# Altium schematic sheet TouchORkey.SchDoc
size A2
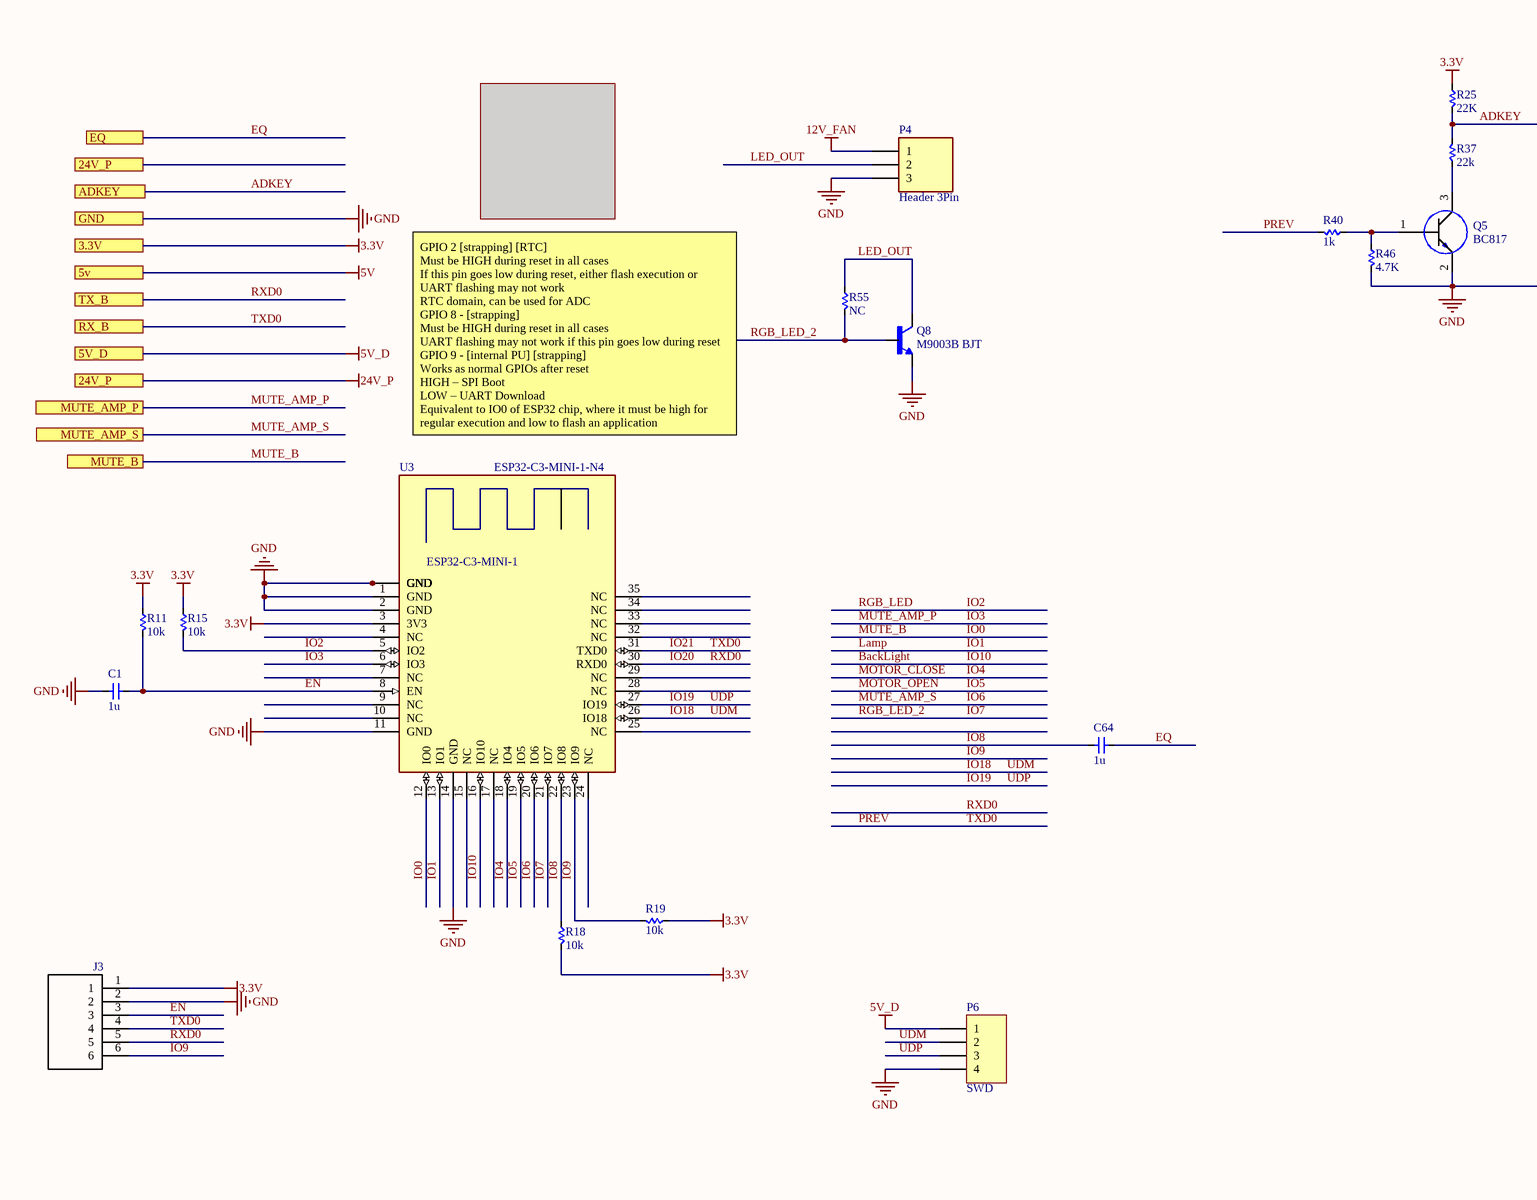
[diagram p0: TouchORkey.SchDoc, left]
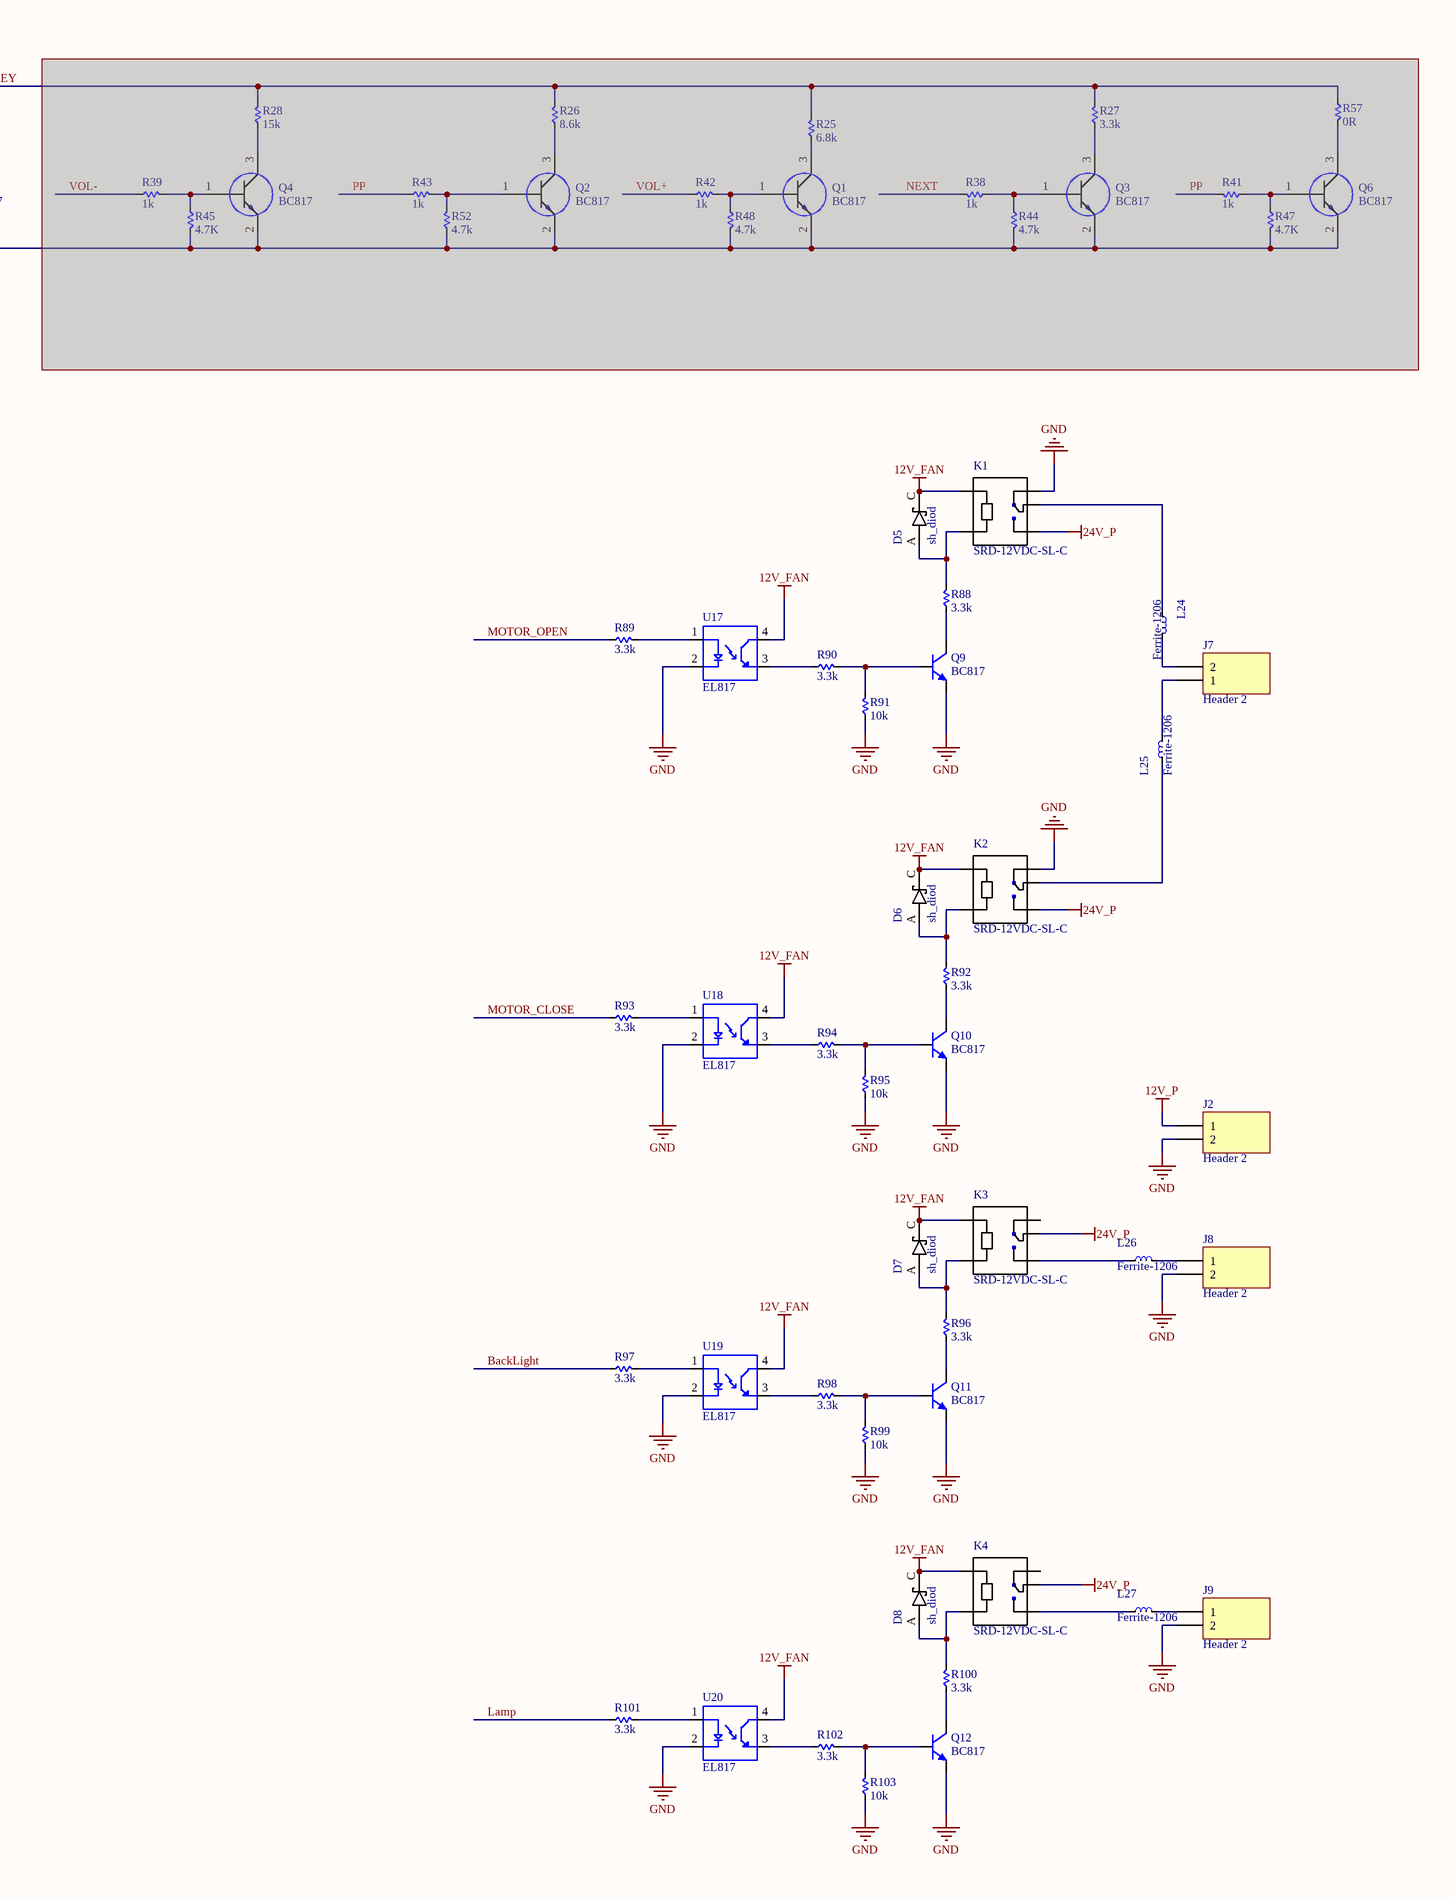
[diagram p1: TouchORkey.SchDoc, right]

## Parts
(Parts that share a designator on the sheet are numbered #1, #2 ... from top to bottom, then left to right.)
C1  1u  [cap0603]
C64  1u  [cap0603]
D5  sh_diod  [SH_diod]
D6  sh_diod  [SH_diod]
D7  sh_diod  [SH_diod]
D8  sh_diod  [SH_diod]
J2  Header 2  [CONN-PHOENIX-5.08]
J3  NC  [pin header1*6]  (value not drawn)
J7  Header 2  [CONN-PHOENIX-5.08]
J8  Header 2  [CONN-PHOENIX-5.08]
J9  Header 2  [CONN-PHOENIX-5.08]
K1  SRD-12VDC-SL-C  [RELAY_SRD-05VDC-SL-C_SRD-05VDC-SL-C(Primary)]
K2  SRD-12VDC-SL-C  [RELAY_SRD-05VDC-SL-C_SRD-05VDC-SL-C(Primary)]
K3  SRD-12VDC-SL-C  [RELAY_SRD-05VDC-SL-C_SRD-05VDC-SL-C(Primary)]
K4  SRD-12VDC-SL-C  [RELAY_SRD-05VDC-SL-C_SRD-05VDC-SL-C(Primary)]
L24  Ferrite-1206  [FERRITE 1206]
L25  Ferrite-1206  [FERRITE 1206]
L26  Ferrite-1206  [FERRITE 1206]
L27  Ferrite-1206  [FERRITE 1206]
P4  Header 3Pin  [CONN-PHOENIX-3.81 3Pin]
P6  SWD  [HDR1X4H]
Q1  BC817  [BJT SS805]  (masked out: inside a compile mask, not in the netlist)
Q2  BC817  [BJT SS805]  (masked out: inside a compile mask, not in the netlist)
Q3  BC817  [BJT SS805]  (masked out: inside a compile mask, not in the netlist)
Q4  BC817  [BJT SS805]  (masked out: inside a compile mask, not in the netlist)
Q5  BC817  [BJT SS805]
Q6  BC817  [BJT SS805]  (masked out: inside a compile mask, not in the netlist)
Q8  M9003B BJT  [M9003 BJT]
Q9  BC817  [BC817]
Q10  BC817  [BC817]
Q11  BC817  [BC817]
Q12  BC817  [BC817]
R11  10k  [RES-0603]
R15  10k  [RES-0603]
R18  10k  [RES-0603]
R19  10k  [RES-0603]
R25#1  22K  [RES-0603]
R25#2  6.8k  [RES-0603]  (masked out: inside a compile mask, not in the netlist)
R26  8.6k  [RES-0603]  (masked out: inside a compile mask, not in the netlist)
R27  3.3k  [RES-0603]  (masked out: inside a compile mask, not in the netlist)
R28  15k  [RES-0603]  (masked out: inside a compile mask, not in the netlist)
R37  22k  [RES-0603]
R38  1k  [RES-0603]  (masked out: inside a compile mask, not in the netlist)
R39  1k  [RES-0603]  (masked out: inside a compile mask, not in the netlist)
R40  1k  [RES-0603]
R41  1k  [RES-0603]  (masked out: inside a compile mask, not in the netlist)
R42  1k  [RES-0603]  (masked out: inside a compile mask, not in the netlist)
R43  1k  [RES-0603]  (masked out: inside a compile mask, not in the netlist)
R44  4.7k  [RES-0603]  (masked out: inside a compile mask, not in the netlist)
R45  4.7K  [RES-0603]  (masked out: inside a compile mask, not in the netlist)
R46  4.7K  [RES-0603]
R47  4.7K  [RES-0603]  (masked out: inside a compile mask, not in the netlist)
R48  4.7k  [RES-0603]  (masked out: inside a compile mask, not in the netlist)
R52  4.7k  [RES-0603]  (masked out: inside a compile mask, not in the netlist)
R55  NC  [RES-0603]
R57  0R  [RES-0603]  (masked out: inside a compile mask, not in the netlist)
R88  3.3k  [RES-0603]
R89  3.3k  [RES-0603]
R90  3.3k  [RES-0603]
R91  10k  [RES-0603]
R92  3.3k  [RES-0603]
R93  3.3k  [RES-0603]
R94  3.3k  [RES-0603]
R95  10k  [RES-0603]
R96  3.3k  [RES-0603]
R97  3.3k  [RES-0603]
R98  3.3k  [RES-0603]
R99  10k  [RES-0603]
R100  3.3k  [RES-0603]
R101  3.3k  [RES-0603]
R102  3.3k  [RES-0603]
R103  10k  [RES-0603]
U3  ESP32-C3-MINI-1-N4  [ESP32-C3-MINI-1]
U17  EL817  [EL817]
U18  EL817  [EL817]
U19  EL817  [EL817]
U20  EL817  [EL817]

## Ports
3.3V, 5v, 5V_D, 24V_P, ADKEY, EQ, GND, MUTE_AMP_P, MUTE_AMP_S, MUTE_B, RX_B, TX_B

## Nets
3.3V: J3.1 R11.1 R15.1 R18.2 R19.1 R25#1.1 U3.3(3V3) ; port 3.3V
5V: port 5v
5V_D: P6.1 ; port 5V_D
12V_FAN: D5.C(K) D6.C(K) D7.C(K) D8.C(K) K1.A1 K2.A1 K3.A1 K4.A1 P4.1 U17.4(CT) U18.4(CT) U19.4(CT) U20.4(CT)
12V_P: J2.1
24V_P: K1.NO K2.NO K3.COM K4.COM ; port 24V_P
GND: C1.1 J2.2 J3.2 J8.2 J9.2 K1.NC K2.NC P4.3 P6.4 Q5.2(E) Q8.2(C) Q9.2(E) Q10.2(E) Q11.2(E) Q12.2(E) R46.2 R91.1 R95.1 R99.1 R103.1 U3.1(GND) U3.2(GND) U3.11(GND) U3.14(GND) U3.36(GND) U3.37(GND) U3.38(GND) U3.39(GND) U3.40(GND) U3.41(GND) U3.42(GND) U3.43(GND) U3.44(GND) U3.45(GND) U3.46(GND) U3.47(GND) U3.48(GND) U3.49_1(GND) U3.49_2(GND) U3.49_3(GND) U3.49_4(GND) U3.49_5(GND) U3.49_6(GND) U3.49_7(GND) U3.49_8(GND) U3.49_9(GND) U3.50(GND) U3.51(GND) U3.52(GND) U3.53(GND) U17.2(C) U18.2(C) U19.2(C) U20.2(C) ; port GND
ADKEY: R25#1.2 R37.2 ; port ADKEY
BackLight: R97.1 U3.16(IO10)  [also labelled IO10]
EN: C1.2 J3.3 R11.2 U3.8(EN)
EQ: C64.2 ; port EQ
IO0: U3.12(IO0) ; port MUTE_B  [also labelled MUTE_B]
IO1: R101.1 U3.13(IO1)  [also labelled Lamp]
IO2: R15.2 U3.5(IO2)  [also labelled RGB_LED]
IO3: U3.6(IO3) ; port MUTE_AMP_P  [also labelled MUTE_AMP_P]
IO4: R93.1 U3.18(IO4)  [also labelled MOTOR_CLOSE]
IO5: R89.1 U3.19(IO5)  [also labelled MOTOR_OPEN]
IO6: U3.20(IO6) ; port MUTE_AMP_S  [also labelled MUTE_AMP_S]
IO7: Q8.1(B) R55.2 U3.21(IO7)  [also labelled RGB_LED_2]
IO8: C64.1 R18.1 U3.22(IO8)
IO9: J3.6 R19.2 U3.23(IO9)
IO18: P6.2 U3.26(IO18)  [also labelled UDM]
IO19: P6.3 U3.27(IO19)  [also labelled UDP]
IO20: J3.5 U3.30(RXD0) ; port TX_B  [also labelled RXD0]
IO21: J3.4 R40.2 U3.31(TXD0) ; port RX_B  [also labelled PREV, TXD0]
LED_OUT: P4.2 Q8.3(E) R55.1
NetD5_A: D5.A K1.A2 R88.2
NetD6_A: D6.A K2.A2 R92.2
NetD7_A: D7.A K3.A2 R96.2
NetD8_A: D8.A K4.A2 R100.2
NetJ7_1: J7.1 L25.1
NetJ7_2: J7.2 L24.1
NetJ8_1: J8.1 L26.1
NetJ9_1: J9.1 L27.1
NetK1_COM: K1.COM L24.2
NetK2_COM: K2.COM L25.2
NetK3_NO: K3.NO L26.2
NetK4_NO: K4.NO L27.2
NetQ5_1: Q5.1(B) R40.1 R46.1
NetQ5_3: Q5.3(C) R37.1
NetQ9_1: Q9.1(B) R90.2 R91.2
NetQ9_3: Q9.3(C) R88.1
NetQ10_1: Q10.1(B) R94.2 R95.2
NetQ10_3: Q10.3(C) R92.1
NetQ11_1: Q11.1(B) R98.2 R99.2
NetQ11_3: Q11.3(C) R96.1
NetQ12_1: Q12.1(B) R102.2 R103.2
NetQ12_3: Q12.3(C) R100.1
NetR89_2: R89.2 U17.1(A)
NetR90_1: R90.1 U17.3(ET)
NetR93_2: R93.2 U18.1(A)
NetR94_1: R94.1 U18.3(ET)
NetR97_2: R97.2 U19.1(A)
NetR98_1: R98.1 U19.3(ET)
NetR101_2: R101.2 U20.1(A)
NetR102_1: R102.1 U20.3(ET)

Not connected (* = marked no-connect by the designer): K3 NC; K4 NC; U3 4(NC) 7(NC) 9(NC) 10(NC) 15(NC) 17(NC) 24(NC) 25(NC) 28(NC) 29(NC) 32(NC) 33(NC) 34(NC) 35(NC)

## Notes on the sheet
- GPIO 2 [strapping] [RTC]
  Must be HIGH during reset in all cases
  If this pin goes low during reset, either flash execution or UART flashing may not work
  RTC domain, can be used for ADC
  GPIO 8 - [strapping]
  Must be HIGH during reset in all cases
  UART flashing may not work if this pin goes low during reset
  GPIO 9 - [internal PU] [strapping]
  Works as normal GPIOs after reset
  HIGH – SPI Boot
  LOW – UART Download
  Equivalent to IO0 of ESP32 chip, where it must be high for regular execution and low to flash an application
- (in symbol ESP32-C3-MINI-1-N4) ESP32-C3-MINI-1

## Library data of the parts
C1 C64 = Cap 0603: Capacitor 0603; Value: 104; Published: 8-Jun-2000; LatestRevisionDate: 17-Jul-2002; LatestRevisionNote: Re-released for DXP Platform.; Publisher: Altium Limited
D5-D8 = sh_diod: MF: ON Semiconductor; MP: SS34; Package: None; Price: None; Availability: Unavailable; SnapEDA_Link: https://www.snapeda.com/parts/SS34/ON%20Semiconductor/view-part/4479478/?ref=snap; Value: *
J2 J7-J9 = CONN-Phoenix-5.08: Phoenix Connector 5.08; LatestRevisionDate: 17-Jul-2002; LatestRevisionNote: Re-released for DXP Platform.; Publisher: Altium Limited
J3 = pin header 06: Pin Connector 06 MODII HDR SRST B/A .100CL 6 POS; MF: TE Connectivity; MP: 5-146283-6; Price: None; SnapEDA_Link: https://www.snapeda.com/parts/5-146283-6/TE%20Connectivity%20AMP%20Connectors/view-part/?ref=snap; Availability: Unavailable; TE_purchase_URL: https://www.te.com/usa-en/product-5-146283-6.html?te_bu=Cor&te_type=disp&te_campaign=seda_glo_cor-seda-global-disp-prtnr-fy19-seda-model-bom-cta_sma-317_1&elqCampaignId=32493; Package: None; Value: *
K1-K4 = RELAY-SRD: 5V Trigger Relay Module For Arduino And Raspberry Pi 5V Trigger Relay Module For Arduino And Raspberry Pi; MP: SRD-05VDC-SL-C; MF: Songle Relay; SnapEDA_Link: https://www.snapeda.com/parts/SRD-05VDC-SL-C/Songle%20Relay/view-part/1029484/?ref=snap; Availability: Unavailable; Price: None; Package: None; Value: *
L24-L27 = Ferrite _1206: BLM Series 1206 330 Ohm 400 mA 0.58 Ohm DCR Surface Mount Ferrite Bead; MF: Murata; MP: BLM18BB331SN1D; Package: 0603 Murata; Price: None; Availability: Unavailable; SnapEDA_Link: https://www.snapeda.com/parts/BLM18BB331SN1D/Murata%20Electronics%20North%20America/view-part/?ref=snap; Value: *
P4 = CONN-Phoenix-3.81 3Pin: Phoenix Connector 3.81; LatestRevisionDate: 17-Jul-2002; LatestRevisionNote: Re-released for DXP Platform.; Publisher: Altium Limited
P6 = pin header 1X4: Header, 4-Pin; LatestRevisionDate: 17-Jul-2002; LatestRevisionNote: Re-released for DXP Platform.; Publisher: Altium Limited
Q1-Q6 = SS8050-G BJT_ Transistor: Bipolar _BJT_ Transistor NPN 25V 1.5A 100MHz 300mW Surface Mount SOT-23; MF: Comchip Technology; SnapEDA_Link: https://www.snapeda.com/parts/SS8050-G/Comchip%20Technology/view-part/809142/?ref=snap; Price: None; MP: SS8050-G; Package: TO-236 Comchip; Availability: Unavailable; Value: *
Q8 = M9003B: Bipolar (BJT) Transistor NPN TO-252, (D-Pak); MF: Diodes Inc.; MP: 2DB1184Q-13; SnapEDA_Link: https://www.snapeda.com/parts/2DB1184Q-13/Diodes+Inc./view-part/?ref=snap; Package: TO-252-3 Diodes Inc.; Value: *; Check_prices: https://www.snapeda.com/parts/2DB1184Q-13/Diodes+Inc./view-part/?ref=eda
Q9-Q12 = BC817: NPN General Purpose Amplifier BJT; Published: 8-Jun-2000; LatestRevisionDate: 15-Jan-2003; LatestRevisionNote: PCB Footprint 'BCY-W3/D4.7' replaced; DatasheetVersion: 1997; PackageVersion: Sep-1998; PackageReference: TO-92A; Publisher: Altium Limited; PackageDescription: TO, Flat Index; 3 In-Line, Axial Leads; Body Dia. 4.5mm; Leads 0.51 x 0.48 mm (max); ComponentLink1Description: Manufacturer Link; ComponentLink1URL: http://www.fairchildsemi.com/; ComponentLink2Description: Datasheet; ComponentLink2URL: http://www.fairchildsemi.com/ds/2N%2F2N3904.pdf
R11 R15 R18 R19 R25#1 R25#2 R26-R28 R37-R48 R52 R55 R57 R88-R103 = Res 0603: Resistor 0603; Published: 8-Jun-2000; LatestRevisionDate: 29-May-2009; LatestRevisionNote: IPC-7351 Footprint Added.; PackageReference: J1-0603; Publisher: Altium Limited; PackageDescription: Chip Resistor
  R11 R15 R25#1 R25#2 R26-R28 R37-R48 R52 R57: Value: *
U3 = ESP32-C3-MINI-1-N4: MF: {'manufacturer': u'Espressif Systems'}; Package: None; Price: None; Value: *; MP: ESP32-C3-MINI-1-N4; Availability: Unavailable
U17-U20 = EL817(S1)(A)(TU)-G: Optoisoltr 5kv Transistor 4-Smd; Package: None; Price: None; Value: *; MP: EL817(S1)(A)(TU)-G; Availability: Unavailable